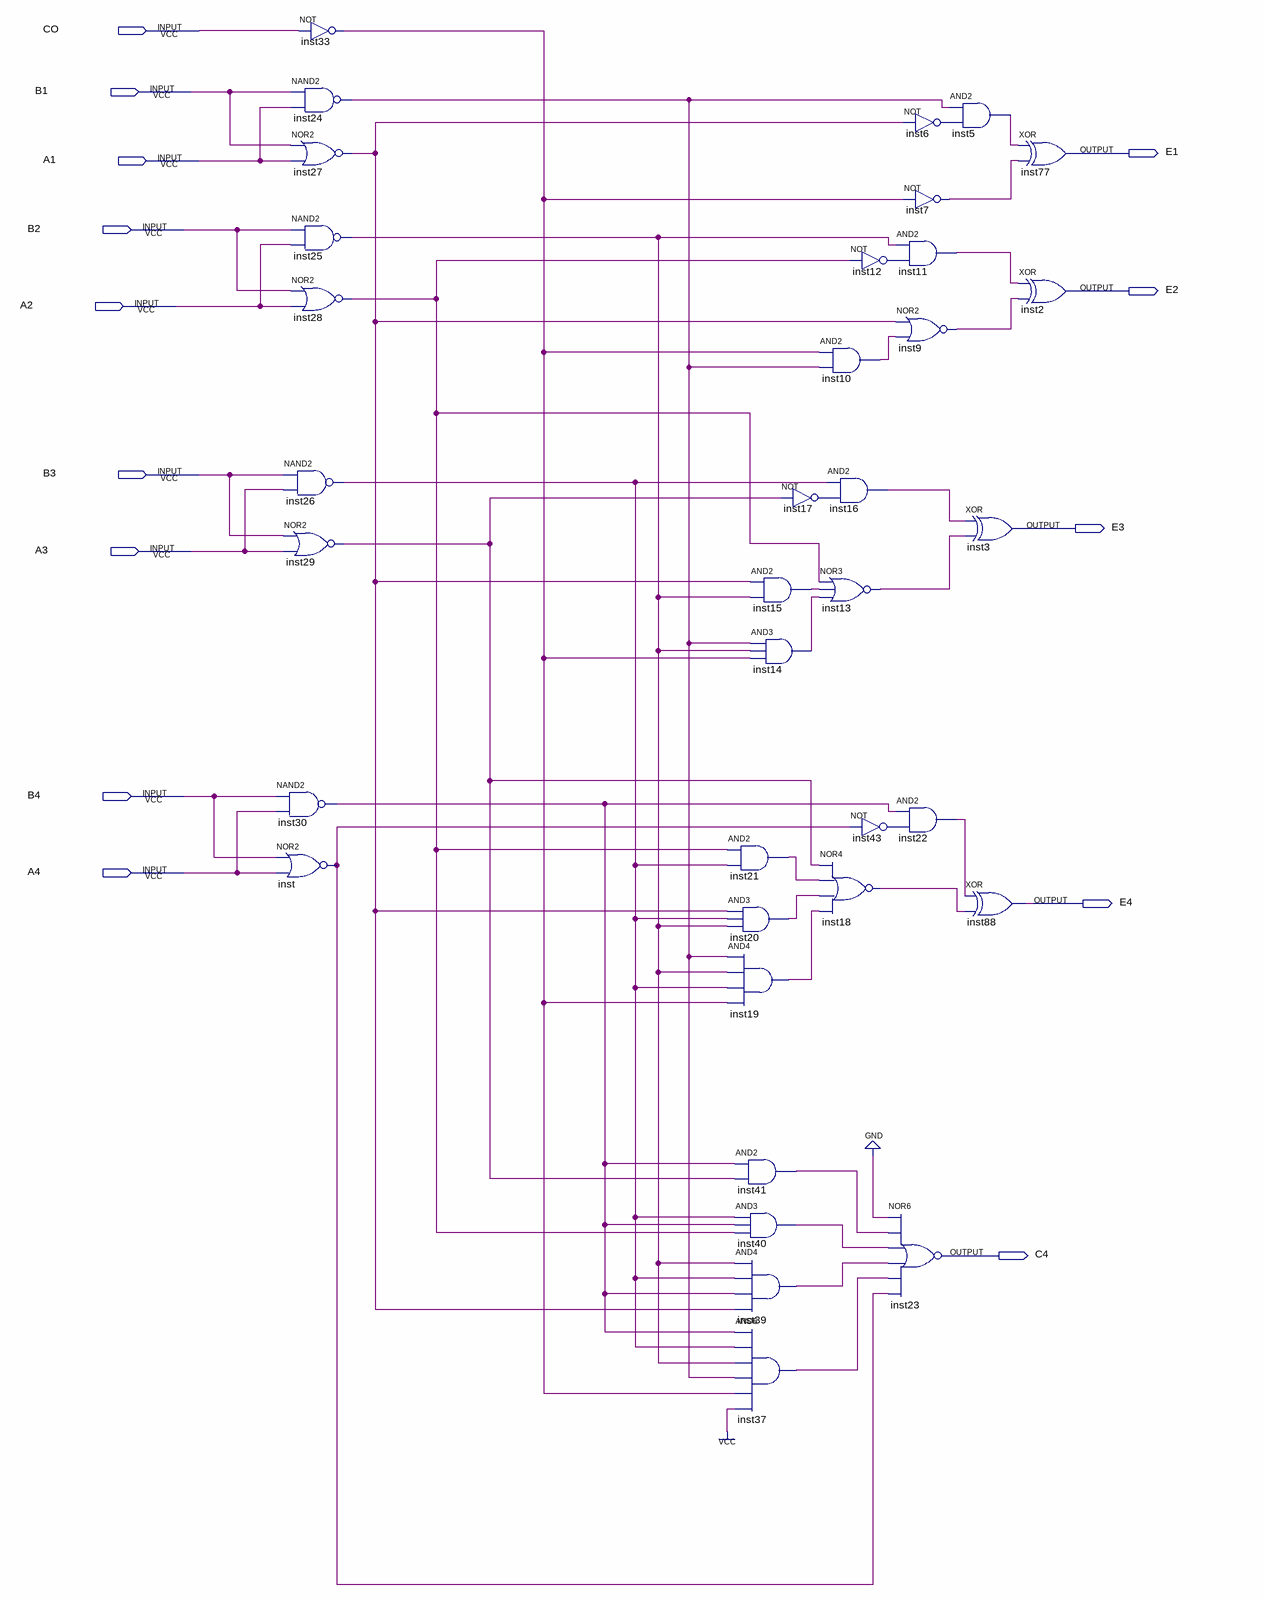
[diagram p0: schematic sheet]
// Quartus schematic CI74LS283_SOMADOR_COMPLETO_4BIT.bdf as structural Verilog: 36 symbols, 14 pins
module CI74LS283_SOMADOR_COMPLETO_4BIT (
  input  CO,
  input  B1,
  input  A1,
  input  B2,
  input  A2,
  input  B3,
  input  A3,
  input  B4,
  input  A4,
  output E1,
  output E2,
  output E3,
  output E4,
  output C4
);

  wire inst5_out, inst6_out, inst7_out, inst9_out, inst10_out, inst11_out, inst12_out, inst13_out,
       inst14_out, inst15_out, inst16_out, inst17_out, inst18_out, inst19_out, inst20_out, inst21_out,
       inst22_out, inst24_out, inst25_out, inst26_out, inst27_out, inst28_out, inst29_out, inst30_out,
       inst33_out, inst37_out, inst39_out, inst40_out, inst41_out, inst43_out, inst_out;

  nand inst24 (inst24_out, B1, A1);
  nor inst27 (inst27_out, B1, A1);
  nand inst25 (inst25_out, B2, A2);
  nor inst28 (inst28_out, B2, A2);
  nand inst26 (inst26_out, B3, A3);
  nor inst29 (inst29_out, B3, A3);
  nand inst30 (inst30_out, B4, A4);
  nor inst (inst_out, B4, A4);
  not inst33 (inst33_out, CO);
  not inst17 (inst17_out, inst29_out);
  and inst15 (inst15_out, inst27_out, inst25_out);
  and inst14 (inst14_out, inst24_out, inst25_out, inst33_out);
  and inst21 (inst21_out, inst28_out, inst26_out);
  and inst20 (inst20_out, inst27_out, inst26_out, inst25_out);
  and inst19 (inst19_out, inst24_out, inst25_out, inst26_out, inst33_out);
  and inst41 (inst41_out, inst30_out, inst29_out);
  and inst40 (inst40_out, inst26_out, inst30_out, inst28_out);
  and inst39 (inst39_out, inst25_out, inst26_out, inst30_out, inst27_out);
  and inst37 (inst37_out, inst30_out, inst26_out, inst25_out, inst24_out, inst33_out, 1'b1);
  and inst10 (inst10_out, inst33_out, inst24_out);
  and inst16 (inst16_out, inst26_out, inst17_out);
  nor inst13 (inst13_out, inst28_out, inst15_out, inst14_out);
  nor inst18 (inst18_out, inst29_out, inst21_out, inst20_out, inst19_out);
  not inst6 (inst6_out, inst27_out);
  not inst7 (inst7_out, inst33_out);
  and inst11 (inst11_out, inst25_out, inst12_out);
  not inst12 (inst12_out, inst28_out);
  nor inst9 (inst9_out, inst27_out, inst10_out);
  and inst22 (inst22_out, inst30_out, inst43_out);
  not inst43 (inst43_out, inst_out);
  nor inst23 (C4, 1'b0, inst41_out, inst40_out, inst39_out, inst37_out, inst_out);
  and inst5 (inst5_out, inst24_out, inst6_out);
  xor inst3 (E3, inst16_out, inst13_out);
  xor inst88 (E4, inst22_out, inst18_out);
  xor inst77 (E1, inst5_out, inst7_out);
  xor inst2 (E2, inst11_out, inst9_out);
endmodule
